# EAGLE board 6502-shield (EAGLE 9.6.0)
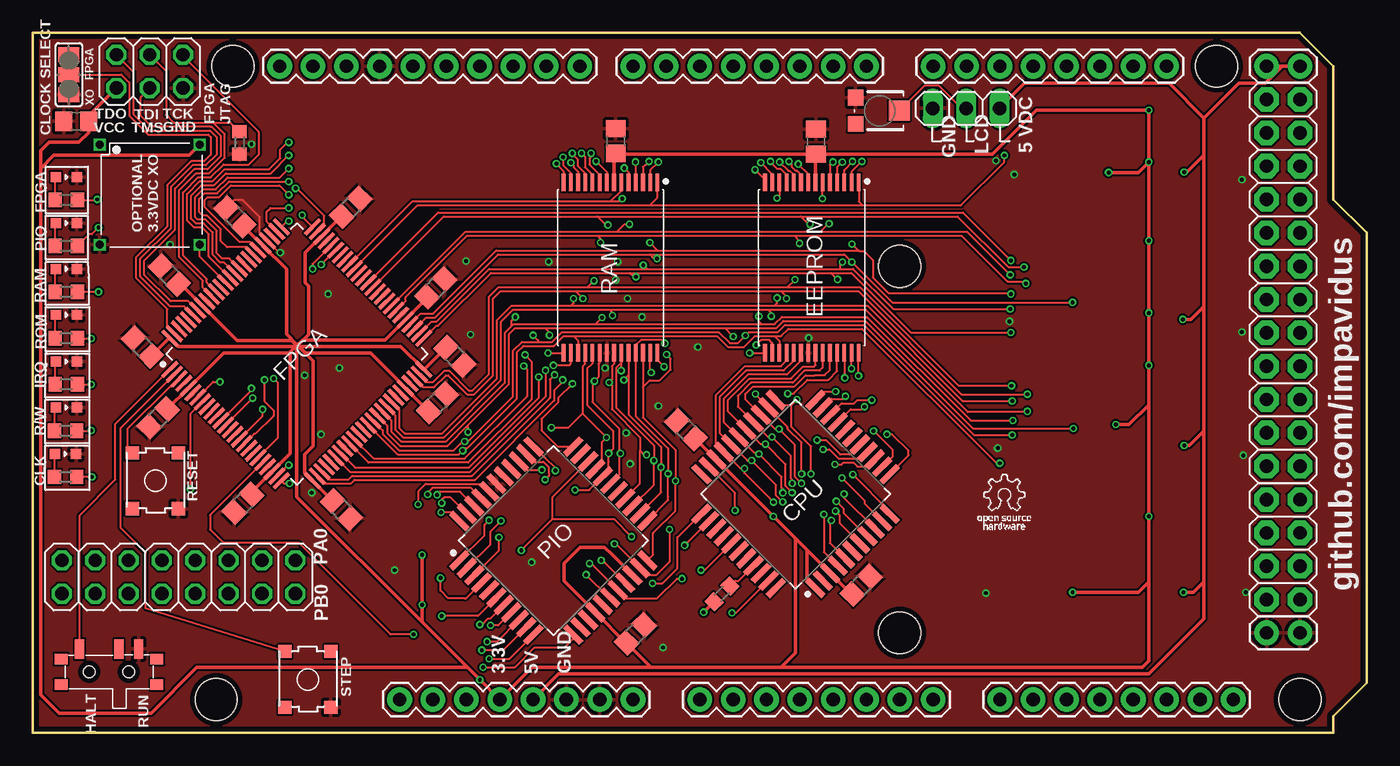
[diagram p3: board, top side]
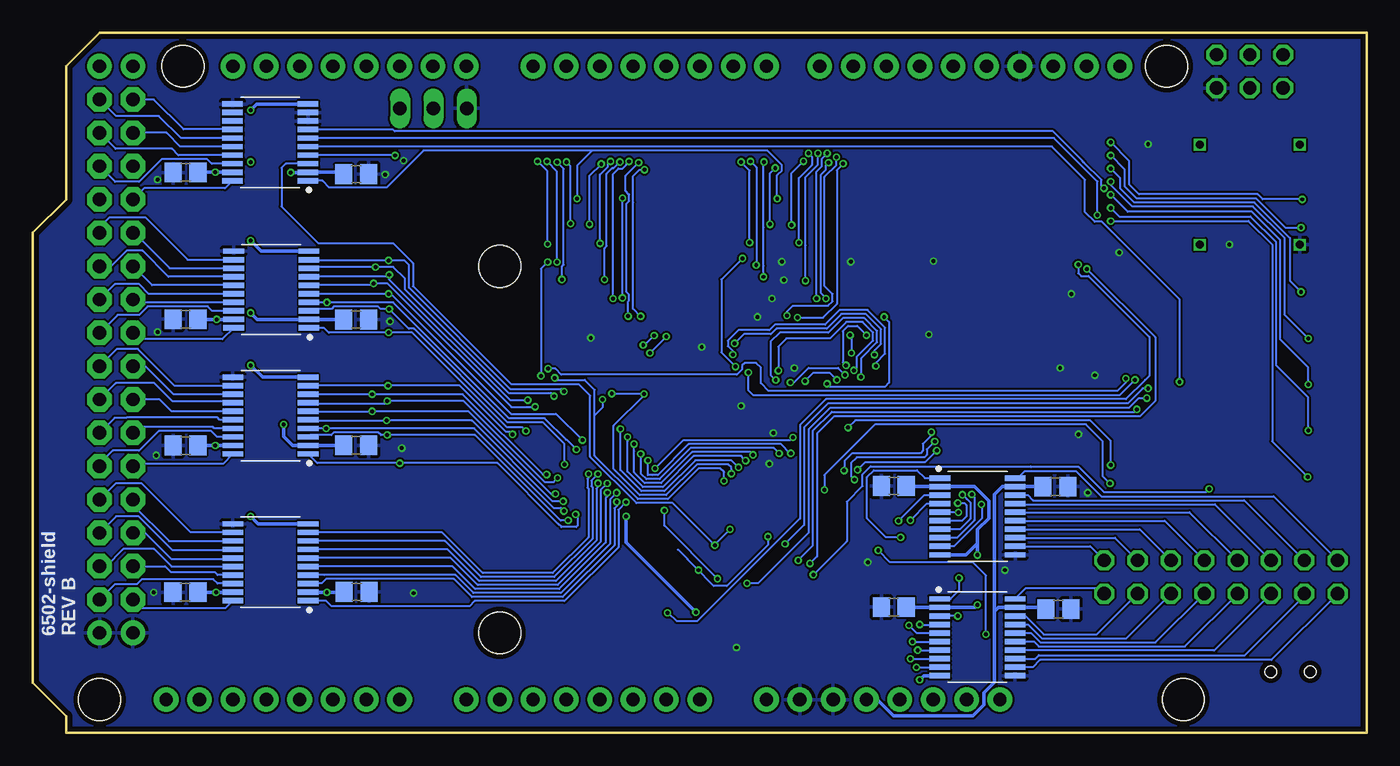
[diagram p4: board, bottom side, seen from below]

Size 101.6 x 53.34 mm. Coordinates in mm from the lower left corner, seen from the top.
Copper layers (1*16): Top 0.035559375mm / dielectric 1.6mm / Bottom 0.035559375mm
Design rules "oshpark-2layer": minimum track width 6mil, minimum drill 10mil, track to track 6mil, track to pad 6mil, pad to pad 6mil, via to via 6mil, smd to smd 6mil, copper to edge 15mil, drill to drill 6mil, minimum pad ring 5mil, minimum via ring 5mil, stop-mask expansion 2.5mil, vias tented up to drill 0mil, thermal gap 10mil
Net classes: 1 power: width 0.254 mm

## Footprints (pad centres in the part's own frame; a part is rotated, then mirrored left to right if it is on the bottom)
C0805 = smd 1.3 x 1.5: 1 -0.95,0; 2 0.95,0
QFP80P1320X1320X270-44N = smd 1.768 x 0.459: 1 -6.13,4; 2 -6.13,3.2; 3 -6.13,2.4; 4 -6.13,1.6; 5 -6.13,0.8; 6 -6.13,0; 7 -6.13,-0.8; 8 -6.13,-1.6; 9 -6.13,-2.4; 10 -6.13,-3.2; 11 -6.13,-4; 23 6.13,-4; 24 6.13,-3.2; 25 6.13,-2.4; 26 6.13,-1.6; 27 6.13,-0.8; 28 6.13,0; 29 6.13,0.8; 30 6.13,1.6; 31 6.13,2.4; 32 6.13,3.2; 33 6.13,4 | smd 0.459 x 1.768: 12 -4,-6.13; 13 -3.2,-6.13; 14 -2.4,-6.13; 15 -1.6,-6.13; 16 -0.8,-6.13; 17 0,-6.13; 18 0.8,-6.13; 19 1.6,-6.13; 20 2.4,-6.13; 21 3.2,-6.13; 22 4,-6.13; 34 4,6.13; 35 3.2,6.13; 36 2.4,6.13; 37 1.6,6.13; 38 0.8,6.13; 39 0,6.13; 40 -0.8,6.13; 41 -1.6,6.13; 42 -2.4,6.13; 43 -3.2,6.13; 44 -4,6.13
WL-SMCD_0603 = smd 0.8 x 0.75: 1 -0.8,0; 2 0.8,0
SOP55P1340X120-28N = smd 1.336 x 0.28: 1 -6.489,3.575; 2 -6.489,3.025; 3 -6.489,2.475; 4 -6.489,1.925; 5 -6.489,1.375; 6 -6.489,0.825; 7 -6.489,0.275; 8 -6.489,-0.275; 9 -6.489,-0.825; 10 -6.489,-1.375; 11 -6.489,-1.925; 12 -6.489,-2.475; 13 -6.489,-3.025; 14 -6.489,-3.575; 15 6.489,-3.575; 16 6.489,-3.025; 17 6.489,-2.475; 18 6.489,-1.925; 19 6.489,-1.375; 20 6.489,-0.825; 21 6.489,-0.275; 22 6.489,0.275; 23 6.489,0.825; 24 6.489,1.375; 25 6.489,1.925; 26 6.489,2.475; 27 6.489,3.025; 28 6.489,3.575
DIP8/4 = drill 0.6 square: 1 -3.81,-3.81; 4 3.81,-3.81; 5 3.81,3.81; 8 -3.81,3.81
QFP50P1600X1600X160-100N = smd 1.6 x 0.28: 1 -7.681,6; 2 -7.681,5.5; 3 -7.681,5; 4 -7.681,4.5; 5 -7.681,4; 6 -7.681,3.5; 7 -7.681,3; 8 -7.681,2.5; 9 -7.681,2; 10 -7.681,1.5; 11 -7.681,1; 12 -7.681,0.5; 13 -7.681,0; 14 -7.681,-0.5; 15 -7.681,-1; 16 -7.681,-1.5; 17 -7.681,-2; 18 -7.681,-2.5; 19 -7.681,-3; 20 -7.681,-3.5; 21 -7.681,-4; 22 -7.681,-4.5; 23 -7.681,-5; 24 -7.681,-5.5; 25 -7.681,-6; 51 7.681,-6; 52 7.681,-5.5; 53 7.681,-5; 54 7.681,-4.5; 55 7.681,-4; 56 7.681,-3.5; 57 7.681,-3; 58 7.681,-2.5; 59 7.681,-2; 60 7.681,-1.5; 61 7.681,-1; 62 7.681,-0.5; 63 7.681,0; 64 7.681,0.5; 65 7.681,1; 66 7.681,1.5; 67 7.681,2; 68 7.681,2.5; 69 7.681,3; 70 7.681,3.5; 71 7.681,4; 72 7.681,4.5; 73 7.681,5; 74 7.681,5.5; 75 7.681,6 | smd 0.28 x 1.6: 26 -6,-7.681; 27 -5.5,-7.681; 28 -5,-7.681; 29 -4.5,-7.681; 30 -4,-7.681; 31 -3.5,-7.681; 32 -3,-7.681; 33 -2.5,-7.681; 34 -2,-7.681; 35 -1.5,-7.681; 36 -1,-7.681; 37 -0.5,-7.681; 38 0,-7.681; 39 0.5,-7.681; 40 1,-7.681; 41 1.5,-7.681; 42 2,-7.681; 43 2.5,-7.681; 44 3,-7.681; 45 3.5,-7.681; 46 4,-7.681; 47 4.5,-7.681; 48 5,-7.681; 49 5.5,-7.681; 50 6,-7.681; 76 6,7.681; 77 5.5,7.681; 78 5,7.681; 79 4.5,7.681; 80 4,7.681; 81 3.5,7.681; 82 3,7.681; 83 2.5,7.681; 84 2,7.681; 85 1.5,7.681; 86 1,7.681; 87 0.5,7.681; 88 0,7.681; 89 -0.5,7.681; 90 -1,7.681; 91 -1.5,7.681; 92 -2,7.681; 93 -2.5,7.681; 94 -3,7.681; 95 -3.5,7.681; 96 -4,7.681; 97 -4.5,7.681; 98 -5,7.681; 99 -5.5,7.681; 100 -6,7.681
SJ_2 = smd 1.168 x 1.6: 1 -1.524,0; 2 0,0; 3 1.524,0
2X03 = drill 1.016 octagon: 1 -2.54,-1.27; 2 -2.54,1.27; 3 0,-1.27; 4 0,1.27; 5 2.54,-1.27; 6 2.54,1.27
2X08 = drill 1.016 octagon: 1 -8.89,-1.27; 2 -8.89,1.27; 3 -6.35,-1.27; 4 -6.35,1.27; 5 -3.81,-1.27; 6 -3.81,1.27; 7 -1.27,-1.27; 8 -1.27,1.27; 9 1.27,-1.27; 10 1.27,1.27; 11 3.81,-1.27; 12 3.81,1.27; 13 6.35,-1.27; 14 6.35,1.27; 15 8.89,-1.27; 16 8.89,1.27
1X03 = drill 1.016 long: 1 -2.54,0; 2 0,0; 3 2.54,0
MCSLPT4644B1TR-TACT-SW-NEW = smd 1 x 1: T1 0,0; T2 4.25,0; T3 0,-3.5; T4 4.25,-3.5
ARDUINO_MEGA2560 = drill 1.016 pad 1.88: 0 63.5,50.8; 1 60.96,50.8; 2 58.42,50.8; 3 55.88,50.8; 3.3V 35.56,2.54; 4 53.34,50.8; 5 50.8,50.8; 5V 38.1,2.54; 5V. 93.98,50.8; 5V.. 96.52,50.8; 6 48.26,50.8; 7 45.72,50.8; 8 41.656,50.8; 9 39.116,50.8; 10 36.576,50.8; 11 34.036,50.8; 12 31.496,50.8; 13 28.956,50.8; 14 68.58,50.8; 15 71.12,50.8; 16 73.66,50.8; 17 76.2,50.8; 18 78.74,50.8; 19 81.28,50.8; 20 83.82,50.8; 21 86.36,50.8; A0 50.8,2.54; A1 53.34,2.54; A2 55.88,2.54; A3 58.42,2.54; A4 60.96,2.54; A5 63.5,2.54; A6 66.04,2.54; A7 68.58,2.54; A8 73.66,2.54; A9 76.2,2.54; A10 78.74,2.54; A11 81.28,2.54; A12 83.82,2.54; A13 86.36,2.54; A14 88.9,2.54; A15 91.44,2.54; AREF 23.876,50.8; GND 26.416,50.8; GND. 43.18,2.54; GND.. 40.64,2.54; GND... 93.98,7.62; GND.... 96.52,7.62; I/OREF 30.48,2.54; N/C 27.94,2.54; RESET 33.02,2.54; SCL1 18.796,50.8; SDA1 21.336,50.8; VIN 45.72,2.54 | drill 1.016 pad 1.88 octagon: 22 93.98,48.26; 23 96.52,48.26; 24 93.98,45.72; 25 96.52,45.72; 26 93.98,43.18; 27 96.52,43.18; 28 93.98,40.64; 29 96.52,40.64; 30 93.98,38.1; 31 96.52,38.1; 32 93.98,35.56; 33 96.52,35.56; 34 93.98,33.02; 35 96.52,33.02; 36 93.98,30.48; 37 96.52,30.48; 38 93.98,27.94; 39 96.52,27.94; 40 93.98,25.4; 41 96.52,25.4; 42 93.98,22.86; 43 96.52,22.86; 44 93.98,20.32; 45 96.52,20.32; 46 93.98,17.78; 47 96.52,17.78; 48 93.98,15.24; 49 96.52,15.24; 50 93.98,12.7; 51 96.52,12.7; 52 93.98,10.16; 53 96.52,10.16 | hole 3.2: 15.24,50.8; 13.97,2.54; 66.04,35.56; 66.04,7.62; 90.17,50.8; 96.52,2.54
R0603 = smd 1 x 1.1: 1 -0.85,0; 2 0.85,0
TC33X = smd 1.2 x 1.2: 1 -1,-1.825; 3 1,-1.825 | smd 1.5 x 1.6: 2 0,1.5
PCM12SMTR = smd 0.711 x 1.499: 1 -2.235,1.74; 2 0.762,1.74; 3 2.261,1.74 | smd 0.991 x 0.813: P$1 3.645,-0.978; P$2 3.645,0.978; P$6 -3.645,0.978; P$7 -3.645,-0.978 | hole 0.889: 1.499,0; -1.499,0
SOP65P640X120-20N = smd 1.572 x 0.407: 1 -2.872,2.925; 2 -2.872,2.275; 3 -2.872,1.625; 4 -2.872,0.975; 5 -2.872,0.325; 6 -2.872,-0.325; 7 -2.872,-0.975; 8 -2.872,-1.625; 9 -2.872,-2.275; 10 -2.872,-2.925; 11 2.872,-2.925; 12 2.872,-2.275; 13 2.872,-1.625; 14 2.872,-0.975; 15 2.872,-0.325; 16 2.872,0.325; 17 2.872,0.975; 18 2.872,1.625; 19 2.872,2.275; 20 2.872,2.925

## Placement (x,y rotation side)
C1  0.1uF  [C0805]  24.21,40.05 45 top
C2  0.1uF  [C0805]  30.7,33.9 45 top
C3  0.1uF  [C0805]  10.4,34.88 135 top
C4  0.1uF  [C0805]  15.4,39.33 135 top
C5  0.1uF  [C0805]  9.55,24 225 top
C6  0.1uF  [C0805]  16,17.5 225 top
C7  0.1uF  [C0805]  3.3,46.6 180 top
C8  0.1uF  [C0805]  76.93,10.75 0 bottom
C9  0.1uF  [C0805]  76.98,21.91 0 bottom
C10  0.1uF  [C0805]  76.98,42.57 0 bottom
C11  0.1uF  [C0805]  36.02,18.81 180 bottom
C12  0.1uF  [C0805]  76.98,31.5 0 bottom
C13  0.1uF  [C0805]  36.02,9.59 180 bottom
C14  0.1uF  [C0805]  89.98,10.72 180 bottom
C15  0.1uF  [C0805]  89.97,31.52 180 bottom
C16  0.1uF  [C0805]  89.97,42.7 180 bottom
C17  0.1uF  [C0805]  89.97,21.89 180 bottom
C18  0.1uF  [C0805]  23.73,18.77 0 bottom
C19  0.1uF  [C0805]  23.48,9.43 0 bottom
C20  0.1uF  [C0805]  23.5,17 315 top
C21  0.1uF  [C0805]  30.8,25.15 45 top
C22  0.1uF  [C0805]  32.15,28.7 315 top
C23  0.1uF  [C0805]  8.35,29.4 135 top
C24  0.1uF  [C0805]  45.9,7.55 45 top
C25  0.1uF  [C0805]  49.75,23.1 135 top
C26  0.1uF  [C0805]  63.1,11.25 45 top
C27  0.1uF  [C0805]  59.65,45.05 90 top
C28  0.1uF  [C0805]  44.4,45.1 90 top
CPU  W65C02S  [QFP80P1320X1320X270-44N]  58.1,18.2 135 top
D1  RED  [WL-SMCD_0603]  2.5,21.25 180 top
D2  RED  [WL-SMCD_0603]  2.55,24.8 180 top
D3  RED  [WL-SMCD_0603]  2.55,35.35 180 top
D4  RED  [WL-SMCD_0603]  2.55,31.85 180 top
D5  RED  [WL-SMCD_0603]  2.55,28.3 180 top
D6  RED  [WL-SMCD_0603]  2.55,38.85 180 top
D7  RED  [WL-SMCD_0603]  2.55,42.35 180 top
EEPROM  AT28BV256TSOP-28  [SOP55P1340X120-28N]  59.34,35.45 270 top
EXT_XO  CRYSTAL-OSC-DIP8/4  [DIP8/4]  8.9,41 270 top
FPGA  MACHXO2-FPGA100TQFP  [QFP50P1600X1600X160-100N]  20.12,28.88 45 top
J1  [SJ_2]  2.75,50.15 270 top
JP1  [2X03]  8.9,50.4 0 top
JP2  [2X08]  11.1,11.87 180 top
JP3  [1X03]  71.09,47.59 180 top
PB_RESET  MCSLPT4644B1TR-TACT-SW  [MCSLPT4644B1TR-TACT-SW-NEW]  11.09,21.33 270 top
PB_STEP  MCSLPT4644B1TR-TACT-SW  [MCSLPT4644B1TR-TACT-SW-NEW]  22.7,6.2 270 top
PCB1  ARDUINO_MEGA2560  [ARDUINO_MEGA2560]  0,0 0 top
PIO  W65C22  [QFP80P1320X1320X270-44N]  39.65,14.65 45 top
R2  390  [R0603]  2.55,40.6 0 top
R3  4.7K  [R0603]  15.75,44.95 90 top
R4  390  [R0603]  2.55,37.1 0 top
R5  390  [R0603]  2.5,19.5 0 top
R6  390  [R0603]  2.5,23.02 0 top
R7  390  [R0603]  2.55,26.55 0 top
R8  390  [R0603]  2.55,30.06 0 top
R9  390  [R0603]  2.55,33.61 0 top
R18  10K  [R0603]  52.5,10.6 225 top
R19  10K  [TC33X]  64.5,47.4 270 top
RAM  AS6C62256  [SOP55P1340X120-28N]  44,35.45 270 top
SW_RUNHALT  PCM12SMTR-SPDT-RIGHT-ANG  [PCM12SMTR]  5.8,4.65 0 top
U1  TCB0108-LVL-XLTRTSSOP20  [SOP65P640X120-20N]  83.43,33.78 180 bottom
U2  TCB0108-LVL-XLTRTSSOP20  [SOP65P640X120-20N]  83.5,24.17 180 bottom
U3  TCB0108-LVL-XLTRTSSOP20  [SOP65P640X120-20N]  83.5,13 180 bottom
U4  TCB0108-LVL-XLTRTSSOP20  [SOP65P640X120-20N]  29.64,16.49 0 bottom
U5  TCB0108-LVL-XLTRTSSOP20  [SOP65P640X120-20N]  29.66,7.28 0 bottom
U6  TCB0108-LVL-XLTRTSSOP20  [SOP65P640X120-20N]  83.51,44.99 180 bottom
U$1  OSHW_LOGO  [OSHW_LOGO@1]  72,15.5 0 top

## Tracks (layer width: path | path; a pad name or v marks a point on that pad's centre or on a via)
A0  (via drill 0.3)
  Top 0.152: FPGA.38 27.79,21.2 32.45,21.2 v32.75,21.5 32.95,21.7 33.11,21.7 36.88,25.48 36.88,29 37.37,29.49 39.69,29.49 40.43,30.24 41.2,30.24 | 41.2,30.24 52.12,30.24 52.96,29.39 54.15,29.39 55,30.24 56.5,30.24 | 56.5,30.24 56.86,29.87 EEPROM.17 | 41.2,30.24 41.52,29.91 RAM.17 | 56.5,30.24 57,30.24 57.55,30.79 63.16,30.79 73.4,20.55 v73.65,20.55 | PIO.36 37.65,20.04 v38.77,20.04 | v60.25,16.65 60.25,13.79 CPU.4
  Bottom 0.152: U2.1 79.92,20.55 v73.65,20.55 66.2,20.55 61.58,15.93 | v32.75,21.5 33.65,20.61 38.2,20.61 v38.77,20.04 | v60.25,16.65 60.1,16.5 60.1,15.79 60.21,15.68 61.33,15.68 61.58,15.93 | 61.58,15.93
A0_IO
  Bottom 0.152: U2.20 87.12,20.5 93.8,20.5 PCB1.44
A1  (via drill 0.3)
  Top 0.152: FPGA.39 26.65,23.05 26.65,22.78 27.92,21.51 32.04,21.51 32.54,22.01 32.55,22.01 32.75,22.21 v32.9,22.21 33.16,22.21 36.58,25.63 36.58,29.13 37.25,29.79 38.5,29.79 | 38.5,29.79 39.56,29.79 40.3,30.54 52.24,30.54 53.09,29.69 53.7,29.69 54.27,30.27 v54.27,30.27 54.54,30.54 56.75,30.54 57.3,31.09 63.29,31.09 71.69,22.69 v74.6,22.69 | v39.65,28 40.85,28 40.98,28.12 RAM.16 | v38.1,30.3 38.5,29.89 38.5,29.79 | EEPROM.16 56.31,29.72 56.1,29.93 55.48,29.93 v55.1,29.55 | PIO.35 38.17,20.65 38.9,20.65 39.3,20.25 39.3,19.78 39.3,19.77 39.3,19.57 v39.02,19.29 | v60.82,16.18 60.7,16.07 60.7,14.47 CPU.5
  Bottom 0.152: U2.3 80.48,22.69 78.87,22.69 78.67,22.89 75.28,22.89 75.08,22.69 v74.6,22.69 67.91,22.69 61.4,16.18 v60.82,16.18 | v32.9,22.21 33.5,21.61 33.5,21.19 33.69,21 38.83,21 39.28,20.55 39.28,19.55 v39.02,19.29 | v39.65,28 39.9,28.25 39.9,30.6 39.5,31 38.8,31 v38.1,30.3 | v54.27,30.27 55,29.55 v55.1,29.55
A1_IO
  Bottom 0.152: U2.18 87.55,22.55 88,23 92,23 93.5,21.5 95.5,21.5 96.52,20.48 PCB1.45
A2  (via drill 0.3)
  Top 0.152: FPGA.40 27,23.41 27,22.86 27.98,21.87 31.58,21.87 33.15,23.45 | 33.15,23.45 36.27,26.57 36.27,30.37 36.74,30.84 39,30.84 | v79.25,23.2 71.61,23.2 63.42,31.39 57.18,31.39 56.63,30.84 52.7,30.84 | 39,30.84 52.7,30.84 | 39,30.84 39.35,30.5 v39.35,30.3 | RAM.15 40.36,28.9 39.3,28.9 v39.25,28.95 | v53.35,30.2 52.7,30.84 | v33.15,22.91 33.15,23.45 | v54.6,28.95 v54.61,28.96 EEPROM.15 | PIO.34 39,20.95 39.03,20.95 39.81,20.18 v39.81,19.99 | v61.15,16.9 61.45,16.6 61.45,15.98 CPU.7
  Bottom 0.152: U2.4 v79.25,23.2 67.99,23.2 61.94,17.15 61.4,17.15 v61.15,16.9 | v39.35,30.3 39.25,30.2 v39.25,28.95 | v54.6,28.95 v53.35,30.2 | v33.15,22.91 33.15,22.68 33.8,22.02 33.8,21.5 34,21.3 39.21,21.3 39.78,20.73 39.78,20.02 v39.81,19.99
A2_IO
  Bottom 0.152: U2.17 87.77,23.2 87.87,23.3 93.53,23.3 PCB1.42
A3  (via drill 0.3)
  Top 0.152: FPGA.41 27.3,23.81 27.3,22.98 28.07,22.22 31.49,22.22 35.97,26.7 35.97,30.5 36.48,31.02 | 36.48,31.02 36.62,31.15 42.86,31.15 | v74.65,23.79 71.45,23.79 63.54,31.7 57.05,31.7 56.5,31.15 55.5,31.15 | 42.86,31.15 55.5,31.15 | 42.86,31.15 v43.35,31.64 | v39.88,43.38 40.09,43.17 40.09,43.13 40.42,42.79 RAM.14 | 55.5,31.15 55.3,31.35 v55.3,31.74 | v55,42.9 55.76,42.14 EEPROM.14 | 36.48,31.02 36.48,31.43 v36.75,31.7 | v41.1,26.6 40.02,25.52 40.02,25.18 38.75,23.92 38.75,23.05 39.99,21.81 PIO.33 | v61.2,17.65 61.75,17.1 61.75,16.75 63.5,15 CPU.8
  Bottom 0.152: U2.5 80.57,23.79 v74.65,23.79 68.15,23.79 62.01,17.65 v61.2,17.65 | v43.35,31.64 41.4,31.64 40.36,32.68 40.36,42.87 39.88,43.35 v39.88,43.38 | v55.3,31.74 55.88,32.32 55.88,40.39 55.86,40.41 55.86,42.44 55.4,42.9 v55,42.9 | v36.75,31.7 36.38,31.32 36.38,26.69 36.7,26.36 40.87,26.36 v41.1,26.6
A3_IO
  Bottom 0.152: U2.16 87.35,23.85 87.53,24.03 94.46,24.03 94.49,24 95.38,24 PCB1.43
A4  (via drill 0.3)
  Top 0.152: FPGA.42 27.61,24.21 27.61,23.11 28.2,22.52 31.31,22.52 35.66,26.88 35.66,31.32 36.59,32.24 43.95,32.24 | v75.75,24.5 75.7,24.45 71.22,24.45 63.43,32.24 56,32.24 | 43.95,32.24 56,32.24 | v44.15,31.8 44.15,32.05 43.95,32.24 | RAM.13 40.99,41.96 40.99,42.65 40.39,43.25 v40.39,43.86 | 56,32.24 56.25,32 v56.25,31.75 | v55.45,43.45 56.31,42.59 EEPROM.13 | v61.8,18.2 61.8,17.89 CPU.9
  Bottom 0.152: U2.6 v75.75,24.5 68.43,24.5 62.13,18.2 v61.8,18.2 | v44.15,31.8 44.15,32.1 43.7,32.55 41.02,32.55 40.69,32.88 40.69,33.44 41.29,34.04 41.29,42.37 40.39,43.27 v40.39,43.86 | v56.25,31.75 56.25,32.87 56.19,32.93 56.19,33.39 56.39,33.59 56.39,40.31 56.17,40.53 56.17,41.02 56.45,41.3 56.45,42.45 v55.45,43.45
A4_IO
  Bottom 0.152: U2.15 91.03,24.5 91.93,25.4 PCB1.40
A5  (via drill 0.3)
  Top 0.152: FPGA.43 27.91,24.62 27.91,23.24 28.32,22.83 31.18,22.83 35.36,27.01 35.36,31.45 36.46,32.55 41,32.55 | v74.6,25.29 70.81,25.29 63.55,32.55 56.5,32.55 | 41,32.55 56.5,32.55 | 41,32.55 41.19,32.74 v41.19,33.09 | v40.99,43.46 41.19,43.26 41.19,43.1 41.52,42.76 RAM.12 | 56.5,32.55 56.69,32.74 v56.69,33.14 | EEPROM.12 56.88,41.92 56.88,40.95 v56.67,40.74 | v61.63,19.42 63.35,17.7 63.35,17.48 CPU.10
  Bottom 0.152: U2.7 80.58,25.15 80.53,25.09 74.8,25.09 v74.6,25.29 68.79,25.29 62.61,19.12 61.93,19.12 v61.63,19.42 | v41.19,33.09 41.19,33.14 41.59,33.54 41.59,42.5 41.19,42.9 41.19,43.25 v40.99,43.46 | v56.67,40.74 56.69,40.76 v56.69,33.14
A5_IO
  Bottom 0.152: U2.14 86.52,25.3 91,25.3 92.35,26.65 95.27,26.65 PCB1.41
A6  (via drill 0.3)
  Top 0.152: FPGA.48 29.72,26.35 30.58,26.35 31.47,27.23 31.63,27.23 33.07,25.8 33.63,25.8 35.05,27.22 35.05,33.08 35.62,33.65 41.35,33.65 | v75.75,25.8 70.73,25.8 62.89,33.65 57,33.65 | 41.35,33.65 57,33.65 | 41.35,33.65 v41.9,33.1 | v41.09,44.16 41.09,44.11 41.49,43.71 41.49,43.22 42.08,42.64 RAM.11 | 57,33.65 57.4,33.24 v57.4,33.1 | v56.18,43.54 56.16,43.52 56.69,42.99 56.95,42.99 57.41,42.52 EEPROM.11 | v62.46,19.68 65.26,16.87 CPU.11
  Bottom 0.152: U2.8 v75.75,25.8 68.86,25.8 62.74,19.68 v62.46,19.68 | v41.9,33.1 41.9,42.77 41.49,43.18 41.49,43.75 41.29,43.95 41.29,43.96 v41.09,44.16 | v57.4,33.1 57.4,42.59 57,42.99 56.68,42.99 56.38,43.29 56.38,43.34 v56.18,43.54
A6_IO
  Bottom 0.152: U2.13 90.89,25.8 93.03,27.94 PCB1.38
A7  (via drill 0.3)
  Top 0.152: FPGA.49 30.07,26.7 30.45,26.7 31.35,27.6 31.7,27.6 33.2,26.1 33.5,26.1 34.75,27.35 34.75,33.23 35.47,33.95 42.25,33.95 | v74.55,26.45 70.52,26.45 63.02,33.95 57.5,33.95 | 42.25,33.95 57.5,33.95 | 42.25,33.95 v42.75,34.45 | RAM.10 42.62,42.52 42.05,43.1 42.05,43.91 v41.8,44.16 | 57.5,33.95 58.05,34.5 v58.05,34.54 | v56.89,43.5 57.55,42.84 57.65,42.84 57.96,42.52 EEPROM.10 | CPU.12 66.7,21.14 66.7,21.5 65.45,22.75 v65.05,22.75
  Bottom 0.152: U2.9 v74.55,26.45 69.08,26.45 65.58,22.95 65.25,22.95 v65.05,22.75 | v42.75,34.45 42.75,37.13 42.74,37.14 42.74,42.36 41.8,43.31 v41.8,44.16 | v58.05,34.54 58.05,36.94 57.89,37.09 57.89,42.61 57.47,43.04 57.38,43.04 56.92,43.5 v56.89,43.5
A7_IO
  Bottom 0.152: U2.12 90.8,26.45 93.6,29.25 95.2,29.25 PCB1.39
A8  (via drill 0.3)
  Top 0.152: FPGA.51 30.76,31.04 30.88,31.04 34.89,35.05 45.45,35.05 | 60.8,35.05 62.35,35.05 66.9,30.5 v74.5,30.5 | 45.45,35.05 60.8,35.05 | 60.8,35.05 v61.3,34.55 | v61.66,43.48 61.26,43.09 EEPROM.4 | v45.95,34.75 45.75,34.75 45.45,35.05 | v45.9,43.5 45.92,43.48 RAM.4 | CPU.13 65.5,21.07 65.5,21.55 v64.05,23 v64.04,23
  Bottom 0.152: U1.1 79.41,30.85 79.06,30.5 v74.5,30.5 72.7,30.5 65.51,23.31 64.35,23.31 v64.04,23 | v61.3,34.55 61.3,35.53 61.17,35.66 61.17,42.99 v61.66,43.48 | v45.95,34.75 45.95,35.59 45.94,35.59 45.94,38.53 45.96,38.54 45.96,43.44 v45.9,43.5
A8_IO
  Bottom 0.152: U1.20 87.16,30 93.5,30 PCB1.36
A9  (via drill 0.3)
  Top 0.152: FPGA.52 30.36,31.34 30.75,31.34 34.76,35.35 46.8,35.35 | v74.45,32.29 65.53,32.29 62.48,35.35 61.5,35.35 | 46.8,35.35 61.5,35.35 | 46.8,35.35 v46.5,35.65 | v46.94,43.54 46.67,43.27 46.64,43.27 46.48,43.11 RAM.3 | 61.5,35.35 61.5,35.7 v61.67,35.87 | v62.44,43.54 62.44,43.51 61.81,42.89 EEPROM.3 | v61.1,20.45 61.6,20.45 61.74,20.59 62.51,20.59 62.8,20.3 63.59,20.3 CPU.14
  Bottom 0.152: U1.3 80.42,32.29 78.85,32.29 78.67,32.48 75.28,32.48 75.1,32.29 v74.45,32.29 72.96,30.8 72.58,30.8 65.43,23.66 62.74,23.66 61.1,22.02 v61.1,20.45 | v46.5,35.65 v46.49,35.65 46.49,43.09 v46.94,43.54 | v61.67,35.87 61.67,42.78 v62.44,43.54
A9_IO
  Bottom 0.152: U1.18 87.94,32.15 88.28,32.49 92.85,32.49 93.5,31.85 95.15,31.85 PCB1.37
A10  (via drill 0.3)
  Top 0.152: FPGA.53 29.95,31.64 30.63,31.64 35.43,36.45 47,36.45 | v79.2,32.8 65.46,32.8 v62.38,35.88 61.81,36.45 47,36.45 | v62.9,27.2 62.9,28.95 EEPROM.28 | 47,36.45 47.3,36.15 v47.55,36.15 | v48.07,27.91 47.58,28.41 RAM.28 | v60.2,21.6 60.67,21.6 61.37,20.89 63.06,20.89 CPU.15
  Bottom 0.152: U1.4 v79.2,32.8 74.14,32.8 65.31,23.97 62.61,23.97 61,22.35 60.95,22.35 v60.2,21.6 | v62.38,35.88 62.9,35.36 v62.9,27.2 | v47.55,36.15 49.15,34.55 49.15,28.98 v48.07,27.91
A10_IO
  Bottom 0.152: U1.17 93.76,32.8 PCB1.34
A11  (via drill 0.3)
  Top 0.152: FPGA.54 29.55,31.95 30.5,31.95 35.3,36.75 47.6,36.75 | 47.6,36.75 62.9,36.75 | v74.5,33.45 74.45,33.5 65.19,33.5 63.98,34.71 63.98,36.02 63.3,36.7 62.95,36.7 62.9,36.75 | 62.9,36.75 v62.4,37.25 | v63.15,43.54 62.36,42.76 EEPROM.2 | 47.6,36.75 v47,37.35 | v47.65,43.5 47.02,42.88 RAM.2 | v59.74,22.31 60.39,22.31 61.5,21.2 62.23,21.2 CPU.16
  Bottom 0.152: U1.5 v74.5,33.45 74.31,33.45 65.17,24.31 61.75,24.31 v59.74,22.31 | v62.4,37.25 62.4,42.79 v63.15,43.54 | v47,37.35 47,42.85 v47.65,43.5
A11_IO
  Bottom 0.152: U1.16 92.76,33.45 93.5,34.19 95.35,34.19 PCB1.35
A12  (via drill 0.3)
  Top 0.152: FPGA.57 28.4,32.92 28.4,33.2 33.09,37.89 43,37.89 | v75.65,34.25 75.5,34.39 74.24,34.39 70.75,37.89 58,37.89 | 43,37.89 58,37.89 | 58,37.89 58.4,37.49 v58.4,37.3 | v57.59,43.54 57.79,43.34 57.79,43.14 58.09,42.84 58.19,42.84 58.51,42.52 EEPROM.9 | 43,37.89 43.25,37.64 v43.25,37.35 | v42.51,44.16 42.51,43.88 42.39,43.76 42.39,43.3 43.17,42.52 RAM.9 | CPU.19 62.29,24.65 63.15,24.65 v63.35,24.85
  Bottom 0.152: U1.6 75.81,34.1 75.67,34.25 v75.65,34.25 74.58,34.25 73.89,33.56 73.89,33.57 65.15,24.82 63.38,24.82 v63.35,24.85 | v57.59,43.54 57.79,43.34 57.79,43.14 58.4,42.53 v58.4,37.3 | v43.25,37.35 43.25,42.28 42.26,43.27 42.26,43.91 v42.51,44.16
A12_IO
  Bottom 0.152: U1.15 92.52,34.1 PCB1.32
A13  (via drill 0.3)
  Top 0.152: FPGA.58 32.96,38.19 44.5,38.19 | v74.45,34.9 71.16,38.19 60,38.19 | 44.5,38.19 60,38.19 | 60,38.19 60.61,38.8 v60.65,38.8 | v60.95,43.5 60.71,43.26 EEPROM.5 | 44.5,38.19 45.06,38.75 v45.45,38.75 | v45.05,43.04 45.38,42.72 RAM.5 | CPU.20 61.61,25.1 62.55,25.1 62.8,25.36 63.56,25.36 63.56,25.35 v63.9,25.35
  Bottom 0.152: U1.7 74.56,34.75 74.47,34.85 74.47,34.88 v74.45,34.9 74.45,34.55 65.25,25.35 v63.9,25.35 | v60.65,38.8 60.65,43.2 v60.95,43.5 | v45.45,38.75 45.45,42.64 v45.05,43.04
A13_IO
  Bottom 0.152: U1.14 91.27,34.75 93.25,36.73 94.46,36.73 95.63,35.56 PCB1.33
A14  (via drill 0.3)
  Top 0.152: FPGA.62 31.29,39.34 43,39.34 | v75.5,35.49 74.29,35.49 70.44,39.34 58.5,39.34 | 43,39.34 58.5,39.34 | 43,39.34 43.65,38.7 v43.8,38.7 | v42.9,43.55 43.73,42.73 RAM.8 | 58.5,39.34 59.09,38.75 v59.2,38.75 | v58.3,43.35 59.06,42.59 EEPROM.8 | CPU.21 60.83,25.45 61.7,25.45 v61.9,25.65
  Bottom 0.152: U1.8 80.47,35.49 v75.5,35.49 74.29,35.49 74.28,35.5 74.15,35.5 73.25,34.6 73.25,33.78 65.36,25.9 62.15,25.9 v61.9,25.65 | v43.8,38.7 43.8,42.65 v42.9,43.55 | v59.2,38.75 59.2,42.45 v58.3,43.35
A14_IO
  Bottom 0.152: U1.13 91.18,35.4 93.88,38.1 PCB1.30
A15  (via drill 0.3)
  Top 0.152: FPGA.63 30.89,39.65 70.85,39.65 v74.5,36 | CPU.22 60.25,26.01 v61.15,26.01
  Bottom 0.152: U1.9 80.51,36 v74.5,36 73.3,36 72.94,35.65 72.94,33.91 65.24,26.2 61.35,26.2 v61.15,26.01
A15_IO
  Bottom 0.152: U1.12 89.81,36.05 93.02,39.27 95.76,39.27 96.52,38.51 PCB1.31
BE  (via drill 0.3)
  Top 0.152: v16.75,25.5 16.74,25.5 FPGA.13 | v47.2,11.4 47.95,11.4 49.1,12.55 49.1,14.9 50.89,16.69 CPU.34
  Bottom 0.152: v16.75,25.5 17.37,25.5 18.11,24.76 40.87,24.76 42.51,23.13 42.51,15.24 46.35,11.4 v47.2,11.4
CLK  (via drill 0.3)
  Top 0.152: FPGA.12 16.65,26.12 v16.65,26.25 | v48.5,15.5 v48.49,15.49 48.49,13.03 47.48,12.02 46.83,12.02 46.27,12.58 PIO.21 44.42,14.4 v44.3,14.4 | v49.65,14.3 51.48,16.13 CPU.35
  Bottom 0.152: v16.65,26.25 17.05,26.25 18.19,25.11 41.02,25.11 42.85,23.28 42.85,15.85 v44.3,14.4 | v48.5,15.5 49.65,14.35 v49.65,14.3 52.86,17.51 55.63,17.51 59.15,21.03 59.15,25.7 59.99,26.54 65.15,26.54 72.64,34.04 72.64,35.79 74.15,37.3 79.85,37.3 82.65,40.1 82.65,43.05 82.33,43.37 U6.3
CLK_IO
  Bottom 0.152: U6.18 87.96,43.37 88.31,43.71 91.79,43.71 93.5,42 95.34,42 PCB1.27
CLK_SEL
  Top 0.152: J1.2 6.74,50.15 7.35,49.54 7.35,48.72 7.35,47.02 8.79,45.59 13.36,45.59 13.55,45.4 13.55,44.05 13.05,43.55 12.05,43.55 10.23,41.73 10.23,38.59 7.89,36.25 7.89,34.65 10.25,32.29 10.25,30.97 FPGA.99
D0  (via drill 0.3)
  Top 0.152: FPGA.24 19.37,20.35 19.45,20.35 v19.5,20.4 | v39.5,23.25 40.8,23.25 41.88,24.32 | EEPROM.18 57.41,28.36 57,27.95 54.25,27.95 52,25.7 52,22.04 CPU.30 53.89,20.15 v54.2,20.15 54.2,19.79 v56.41,17.58 | 41.88,24.32 41.88,27.91 42.08,28.11 RAM.18 | 41.88,24.32 v43.7,22.5 43.35,22.15 43.35,20.61 PIO.30
  Bottom 0.152: v19.5,20.4 19.5,22.25 21.05,23.8 38.95,23.8 v39.5,23.25 | v43.7,22.5 43.9,22.3 52.05,22.3 v54.2,20.15 | v56.41,17.58 57,16.99 57,14.15 61.1,10.05 67.95,10.05 68.35,9.65 78.85,9.65 79.28,10.07 U3.1
D0_IO
  Bottom 0.152: U3.20 86.95,9.5 93.32,9.5 PCB1.52
D1  (via drill 0.3)
  Top 0.152: FPGA.25 19.13,19 v19.55,19 | RAM.19 42.62,28.16 42.23,27.76 42.23,24.99 44.21,23.01 44.21,21.64 v43.87,21.3 43.87,20.68 43.87,20.67 43.87,20 PIO.29 42.37,18.5 v41.3,18.5 | EEPROM.19 57.93,28.93 57.93,28.35 57.19,27.6 54.33,27.6 52.3,25.57 52.3,22.86 CPU.29 54.42,20.75 v54.75,20.75 56.62,18.88 56.62,18.09 v57.12,17.59 | v57.12,17.59
  Bottom 0.152: v19.55,19 20.1,19.55 20.1,22.22 21.38,23.5 37.45,23.5 41.3,19.65 v41.3,18.5 | v43.87,21.3 43.91,21.3 44.61,22 51.64,22 53.99,19.64 54.41,19.64 54.41,19.65 54.75,19.65 v54.75,20.75 | v57.12,17.59 57.12,17.3 57.3,17.12 57.3,14.3 61.25,10.36 68.16,10.36 69.53,11.73 79.26,11.73 79.6,11.39 80.61,11.39 U3.3
D1_IO
  Bottom 0.152: U3.18 87.53,11.38 87.85,11.7 93.3,11.7 93.67,11.33 95.35,11.33 PCB1.53
D2  (via drill 0.3)
  Top 0.152: FPGA.27 22.22,19 24.23,19 24.51,19.27 33.67,19.27 39.71,25.31 39.71,26.1 40.36,26.75 v40.36,26.9 | RAM.20 43.17,28.21 43.08,28.11 43.08,27.1 v42.77,26.8 42.62,26.65 42.62,25.23 44.65,23.2 44.65,21.39 44.7,21.34 | 44.7,21.34 v44.75,21.29 | EEPROM.20 58.53,28.94 58.53,28.4 57.43,27.3 54.46,27.3 52.61,25.45 52.61,23.69 CPU.28 55.05,21.25 v55.3,21.25 57.03,19.52 57.03,18.68 57.13,18.58 v57.13,18.3 | PIO.28 44.7,19.7 44.7,21.34
  Bottom 0.152: v40.36,26.9 40.91,27.45 42.12,27.45 v42.77,26.8 | v44.75,21.29 45.15,21.69 51.51,21.69 53.86,19.34 54.87,19.34 55.26,19.73 55.26,21.21 v55.3,21.25 | v57.13,18.3 57.62,17.8 57.62,14.41 61.38,10.66 68.03,10.66 69.4,12.03 79.39,12.03 79.4,12.03 U3.4
D2_IO
  Bottom 0.152: U3.17 87.53,12.03 87.75,12.25 91.08,12.25 91.53,12.7 PCB1.50
D3  (via drill 0.3)
  Top 0.152: FPGA.28 22.62,19.3 24.05,19.3 24.32,19.58 33.45,19.58 39.4,25.53 39.4,26.93 v39.74,27.28 | 46.25,21.5 46.25,22.52 44.11,24.66 44.11,26.5 v43.91,26.7 44.11,26.9 44.11,27.95 44.27,28.11 RAM.22 | 46.25,21.5 46.56,21.18 v46.75,21.18 | EEPROM.22 59.61,28.01 59.5,27.9 58.67,27.9 57.76,26.99 54.58,26.99 52.91,25.32 52.91,24.52 CPU.27 55.43,22 v55.8,22 57.34,20.46 57.34,18.8 v57.83,18.3 | PIO.26 46.25,18.99 46.25,21.5 | v57.83,18.3
  Bottom 0.152: v43.91,26.7 43.61,26.7 42.5,27.81 40.27,27.81 v39.74,27.28 | v46.75,21.18 46.95,21.39 51.39,21.39 53.74,19.04 55,19.04 55.81,19.84 55.81,21.46 55.8,21.46 v55.8,22 | v57.83,18.3 57.83,18.02 57.96,17.89 57.96,14.5 61.5,10.96 67.9,10.96 69.61,12.68 U3.5
D3_IO
  Bottom 0.152: U3.16 91.03,12.68 92.37,14.02 94.7,14.02 96.02,12.7 PCB1.51
D4  (via drill 0.3)
  Top 0.152: FPGA.31 24.16,19.89 33.32,19.89 39.05,25.61 v39.05,27.62 | v47.3,20.74 47.3,21.9 44.42,24.77 44.42,27.81 44.83,28.21 RAM.23 v44.83,27.61 v44.82,27.6 | v47.3,20.74 v47.31,20.74 | EEPROM.23 60.16,27.83 59.93,27.59 58.79,27.59 57.88,26.69 54.71,26.69 53.7,25.68 53.7,24.86 CPU.26 56.01,22.55 v56.3,22.55 57.75,21.1 57.75,19.39 57.84,19.29 v57.84,19.01 | PIO.25 47.3,18.91 v47.3,20.74
  Bottom 0.152: v39.05,27.62 38.85,27.82 38.85,28.64 37.59,29.89 37.59,30.5 38.4,31.3 39.63,31.3 40.88,30.05 44.2,30.05 44.82,29.43 v44.82,27.6 | v47.31,20.74 47.49,20.93 47.49,20.94 47.63,21.08 51.26,21.08 53.61,18.73 55.12,18.73 56.31,19.91 56.31,22.21 56.3,22.21 v56.3,22.55 | v57.84,19.01 58.34,18.51 58.34,14.56 61.63,11.27 67.72,11.27 69.78,13.32 U3.6
D4_IO
  Bottom 0.152: U3.15 86.42,13.28 91.08,13.28 93.05,15.25 93.44,15.25 93.45,15.24 PCB1.48
D5  (via drill 0.3)
  Top 0.152: FPGA.32 24.54,20.21 33.22,20.21 38.54,25.53 v38.54,27.11 | RAM.24 45.38,27.25 | 45.38,27.25 45.38,24.26 47.85,21.79 v47.85,20.24 47.85,18.32 PIO.24 | v45.01,26.89 45.38,27.25 | EEPROM.24 60.71,27.66 60.3,27.25 59.56,27.25 59.55,27.24 58.87,27.24 58.01,26.38 54.84,26.38 54.28,25.82 54.28,25.42 CPU.25 56.54,23.15 v56.85,23.15 58.05,21.95 58.05,19.52 v58.55,19.02 | v58.55,19.02
  Bottom 0.152: v38.54,27.11 38.5,27.15 38.5,28.55 37.29,29.76 37.29,30.63 38.27,31.61 39.89,31.61 41,30.5 44.7,30.5 45.4,29.8 45.4,27.28 v45.01,26.89 | v47.85,20.24 48.39,20.78 51.13,20.78 53.49,18.43 55.25,18.43 56.85,20.03 v56.85,23.15 | v58.55,19.02 58.55,18.73 58.67,18.61 58.67,14.65 61.76,11.57 67.59,11.57 69.99,13.97 U3.7
D5_IO
  Bottom 0.152: U3.14 86.42,13.93 90.97,13.93 93.55,16.5 95.26,16.5 PCB1.49
D6  (via drill 0.3)
  Top 0.152: FPGA.34 25.57,20.59 33.17,20.59 37.99,25.41 37.99,28.31 v37.49,28.81 | v48.14,29.68 47.89,29.93 46.31,29.93 45.92,29.54 RAM.25 45.92,24.14 48.4,21.67 v48.4,19.75 48.4,18 48.4,17.74 PIO.23 | EEPROM.25 61.26,27.56 60.6,26.9 59,26.9 57.95,25.85 v57.5,25.85 | v55.04,25.82 55.04,25.78 CPU.24 56.35,24.45 57.49,23.3 57.49,23.17 58.56,22.11 v58.56,19.73
  Bottom 0.152: v37.49,28.81 37.49,29.13 36.98,29.64 36.98,30.76 38.14,31.91 40.02,31.91 41.13,30.8 44.95,30.8 45.38,30.38 47.45,30.38 v48.14,29.68 | v48.4,19.75 48.4,20.22 48.65,20.47 51.01,20.47 53.36,18.12 55.38,18.12 57.36,20.1 57.36,23.4 55.04,25.72 v55.04,25.82 55.09,25.87 57.48,25.87 v57.5,25.85 | v58.56,19.73 59.05,19.23 59.05,18.81 58.98,18.73 58.98,14.78 61.88,11.88 67.47,11.88 70.21,14.62 U3.8
D6_IO
  Bottom 0.152: U3.13 91.22,14.62 93.98,17.38 PCB1.46
D7  (via drill 0.3)
  Top 0.152: FPGA.35 24.49,22.37 25.96,20.9 32.89,20.9 37.64,25.64 37.64,27.71 v37.39,27.96 | RAM.26 46.48,26.35 | 46.48,26.35 46.48,24.02 48.95,21.55 v48.95,19.2 48.95,16.92 47.25,15.22 47.25,13.58 PIO.22 | 46.48,26.35 46.98,26.85 47.75,26.85 48.58,27.68 48.58,28.52 v48.28,28.82 | EEPROM.26 61.81,27.09 v61.85,27.05 | CPU.23 56.96,25 57.8,25 | 57.8,25 v58.2,25.4 | v59.27,19.72 59.27,21.83 57.8,23.3 57.8,25
  Bottom 0.152: v37.39,27.96 37.39,28.2 36.68,28.9 36.68,30.88 38.02,32.22 40.14,32.22 41.25,31.11 45.07,31.11 45.5,30.68 47.86,30.68 48.65,29.89 48.65,29.47 48.28,29.1 v48.28,28.82 | v48.95,19.2 48.95,19.87 49.25,20.17 50.88,20.17 53.23,17.82 55.5,17.82 58.8,21.11 58.8,24.2 | v58.2,25.4 58.2,24.8 58.8,24.2 | 58.8,24.2 58.8,26.13 59.57,26.9 61.7,26.9 v61.85,27.05 | v59.27,19.72 59.27,19.44 59.36,19.36 59.36,18.68 59.28,18.61 59.28,14.91 62.01,12.18 67.34,12.18 70.43,15.28 U3.9
D7_IO
  Bottom 0.152: U3.12 89.58,15.28 93.3,19 95.3,19 PCB1.47
DMA  (via drill 0.3)
  Top 0.152: FPGA.74 22.2,38.74 22.2,39.4 20.11,41.49 v20.01,41.49
  Bottom 0.152: v20.01,41.49 20.21,41.69 20.21,42.14 21.53,43.47 21.66,43.59 23.9,45.83 74.04,45.83 74.18,45.97 U6.7
DMA_IO
  Bottom 0.152: U6.14 86.4,45.99 90.12,45.99 92.39,48.26 PCB1.22
EEPROM_PGM  (via drill 0.3)
  Top 0.152: FPGA.75 20.51,39.35 v20.51,39.45
  Bottom 0.152: v20.51,39.45 20.51,42.01 23.82,45.32 U6.6
EEPROM_PGM_IO
  Bottom 0.152: U6.15 90.32,45.32 92,47 95.26,47 PCB1.23
EXT_CLK
  Top 0.152: FPGA.88 12.71,36.28 EXT_XO.5
GND  (via drill 0.3)
  Top 0.152: C4.2 15.33,40.6 16,40.6 17.29,39.31 17.29,38.07 FPGA.79 18.76,36.6 v18.85,36.6
  other vias: 38,13 73.35,43.6 39.3,35.9 44.55,35.9 44.4,34.5 45.3,33.1 46.4,31.7 45.5,20.5 45.2,22.85 47.65,24.9 50.65,29.4 59.1,30.1 73.5,21.7 92.2,21.15 74.4,31.35 92.1,30.55 92.1,42.15 74.75,42.55 16.65,44.85 33.35,30.35 33,35.95 48,6.5 43.6,27.8 23.35,27.8 21.95,22.75 22.5,33.45 10.45,37.2 21.25,18.3 72.6,10.65 92.4,10.7 20.7,27.25 27.55,12.4
  pour Top: -4.5,55.5 -4.5,-2.05 105.65,-2.05 105.75,-1.95 105.75,54.35 105.6,54.5 104.6,55.5
  pour Bottom: -7.5,57.5 -7.5,-4 107.5,-4 107.5,57.5
IO_EN  (via drill 0.3)
  Top 0.152: FPGA.16 17.5,24.14 v17.5,24.65 | v43.3,13.15 43.41,13.15 PIO.19
  Bottom 0.152: v43.3,13.15 42.2,14.25 42.2,23 40.74,24.46 17.69,24.46 v17.5,24.65
IRQ_COPROC  (via drill 0.3)
  Top 0.152: FPGA.7 13.34,26.35 13.34,26.36 13.73,26.75 v14.25,26.75
  Bottom 0.152: v14.25,26.75 14.25,33.03 20.16,38.94 20.72,38.94 21.45,39.67 21.45,42.15 23.97,44.67 U6.5
IRQ_COPROC_IO
  Bottom 0.152: U6.16 90.37,44.67 91.42,45.72 PCB1.24
IRQ_IO  (via drill 0.3)
  Top 0.152: FPGA.8 12,24.3 v12,18.58 | v42.15,12.05 43.88,10.31 PIO.17
  Bottom 0.152: v42.15,12.05 39.6,14.6 39.6,17.6 38.4,18.8 38.4,19.7 37.8,20.3 25.6,20.3 25.55,20.25 21.92,20.25 20,18.33 12.25,18.33 v12,18.58
IRQN  (via drill 0.3)
  Top 0.152: FPGA.70 v21.98,35.69 v21.98,35.68 | CPU.43 56.09,11.66 53.57,9.15 v53.25,9.15
  Bottom 0.152: v21.98,35.68 21.98,35.03 21.75,34.8 21.2,34.8 21.19,34.81 16.55,30.16 16.55,27.2 16.84,26.91 16.86,26.91 18.33,25.44 41.18,25.44 43.16,23.45 43.16,16.34 51,8.5 52.55,8.5 53.2,9.15 v53.25,9.15
LED_0  (via drill 0.3)
  Top 0.152: FPGA.76 19.38,39 v19.5,39 | v4.5,19.5 R5.2
  Bottom 0.152: v19.5,39 9,39 7.21,37.2 7.21,22.2 v4.5,19.5
LED_1  (via drill 0.3)
  Top 0.152: FPGA.77 17.8,38.97 17.8,39.7 18.1,40 v19.5,40 | v4.45,23.05 4.45,23.02 R6.2
  Bottom 0.152: v19.5,40 18.85,39.35 8.85,39.35 6.9,37.4 6.9,28 4.45,25.55 v4.45,23.05
LED_2  (via drill 0.3)
  Top 0.152: FPGA.81 16.55,37.4 15.75,37.4 13.1,40.05 13.1,40.61 13.3,40.81 14.19,40.81 15.08,41.7 18.8,41.7 v19.5,41 | R7.2 v4.45,26.55
  Bottom 0.152: v19.5,41 18.2,39.7 8.75,39.7 6.59,37.55 6.59,29.98 4.45,27.84 v4.45,26.55
LED_3  (via drill 0.3)
  Top 0.152: FPGA.82 16.24,37 14.8,37 14.31,37.49 14.31,38.38 13.28,39.41 12.94,39.41 12.67,39.68 12.67,40.68 13.11,41.11 14.06,41.11 14.95,42.01 v19.5,42.01 v19.5,42 | R8.2 4.44,30.06 v4.45,30.05
  Bottom 0.152: v19.5,42 19.5,41.75 17.85,40.1 8.67,40.1 6.25,37.68 6.25,31.85 v4.45,30.05
LED_4  (via drill 0.3)
  Top 0.152: FPGA.85 14.96,36.16 14.41,36.16 14.01,36.55 14.01,38.25 13.15,39.11 12.56,39.11 12.36,39.3 12.36,40.8 12.98,41.42 13.93,41.42 14.83,42.31 18.81,42.31 v19.5,43 | R9.2 v4.99,33.61 v5,33.6
  Bottom 0.152: v19.5,43 18.8,42.3 18.8,41.5 17.72,40.42 8.55,40.42 5.85,37.71 5.85,34.45 v5,33.6
LED_5  (via drill 0.3)
  Top 0.152: FPGA.86 14.56,35.85 14.28,35.85 13.71,36.43 13.71,38.13 13.03,38.8 12.43,38.8 12.06,39.18 12.06,40.93 12.85,41.72 13.81,41.72 14.7,42.61 18.11,42.61 v19.5,44 | v5,38.5 4.5,38 4.3,38 R4.2
  Bottom 0.152: v19.5,44 18.45,42.95 18.45,41.65 17.53,40.73 8.44,40.73 6.21,38.5 v5,38.5
LED_6  (via drill 0.3)
  Top 0.152: FPGA.87 13.4,36.3 13.4,38 12.9,38.5 12.3,38.5 11.76,39.05 11.76,41.05 12.73,42.03 13.68,42.03 14.61,42.95 18.02,42.95 18.85,43.78 18.85,44.45 19.4,45 v19.5,45 | R2.2 4.85,40.6 v4.9,40.65
  Bottom 0.152: v19.5,45 18.1,43.6 18.1,41.8 17.34,41.04 8.31,41.04 7.93,40.65 v4.9,40.65
N$9
  Top 0.152: R5.1 1.65,21.2 D1.2
N$10
  Top 0.152: R6.1 1.65,24.7 D2.2
N$11
  Top 0.152: R7.1 1.7,28.25 D5.2
N$12
  Top 0.152: R8.1 1.7,31.8 D4.2
N$13
  Top 0.152: R9.1 1.7,35.3 D3.2
N$14
  Top 0.152: R4.1 1.7,38.8 D6.2
N$15
  Top 0.152: R2.1 1.7,42.3 D7.2
N$31
  Top 0.152: R18.1 53.5,11.6 53.76,11.6 CPU.41
N$32
  Top 0.152: JP3.2 70.71,47.59 68.96,49.34 67.94,49.34 R19.2
OE  (via drill 0.3)
  Top 0.152: FPGA.66 29.31,40.2 47,40.2 | 47,40.2 63.2,40.2 | 63.2,40.2 70.69,40.2 74,43.5 v74,44 | 47,40.2 47.58,40.77 RAM.1 | EEPROM.1 62.91,40.48 63.2,40.2
  Bottom 0.152: v74,44 80.62,44 U6.4
OE_IO
  Bottom 0.152: U6.17 90.52,44.02 91,44.5 95.3,44.5 PCB1.25
PA0  (via drill 0.3)
  Top 0.152: v29.35,17.4 29.35,18.4 29.92,18.97 34.2,18.97 PIO.40
  Bottom 0.152: U4.9 31.43,14.21 29.3,16.34 29.3,17.35 v29.35,17.4
PA0_IO
  Bottom 0.152: U4.12 21.06,14.21 JP2.1
PA1  (via drill 0.3)
  Top 0.152: PIO.41 33.37,18.66 30.45,18.66 30.08,18.3 v30.08,18.17
  Bottom 0.152: v30.08,18.17 29.88,17.97 29.88,16.19 31.21,14.87 U4.8
PA1_IO
  Bottom 0.152: U4.13 19.17,14.87 JP2.3
PA2  (via drill 0.3)
  Top 0.152: PIO.42 32.55,18.36 31,18.36 v30.79,18.14
  Bottom 0.152: v30.79,18.14 30.45,17.81 30.44,17.81 30.19,17.56 30.19,16.31 30.99,15.52 U4.7
PA2_IO
  Bottom 0.152: U4.14 17.28,15.52 JP2.5
PA3  (via drill 0.3)
  Top 0.152: PIO.43 31.82,17.96 31.35,17.96 31.15,17.76 v31.15,17.51
  Bottom 0.152: v31.15,17.51 30.64,17.51 30.49,17.36 30.49,16.49 30.82,16.16 U4.6
PA3_IO
  Bottom 0.152: U4.15 15.39,16.16 JP2.7
PA4  (via drill 0.3)
  Top 0.152: PIO.44 31.84,16.8 v31.1,16.8
  Bottom 0.152: v31.1,16.8 32.49,16.8 U4.5
PA4_IO
  Bottom 0.152: U4.16 13.5,16.82 JP2.9
PA5  (via drill 0.3)
  Top 0.152: PIO.1 34.4,15.06 34.4,15.85 v34.75,16.2
  Bottom 0.152: v34.75,16.2 33.48,17.46 U4.4
PA5_IO
  Bottom 0.152: U4.17 26.71,17.41 11.56,17.41 JP2.11
PA6  (via drill 0.3)
  Top 0.152: PIO.2 34.85,14.38 34.85,15.35 v35.65,16.15
  Bottom 0.152: v35.65,16.15 33.69,18.11 U4.3
PA6_IO
  Bottom 0.152: U4.18 25.82,18.11 25.42,17.72 9.33,17.72 JP2.13
PA7  (via drill 0.3)
  Top 0.152: PIO.3 35.5,13.89 v35.5,14.9
  Bottom 0.152: v35.5,14.9 36.6,14.9 38.05,16.35 38.05,19.5 37.55,20 34.24,20 33.66,19.41 U4.1
PA7_IO
  Bottom 0.152: U4.20 26.59,19.41 26.05,19.95 22.15,19.95 20.23,18.02 7.09,18.02 JP2.15
PB0  (via drill 0.3)
  Top 0.152: PIO.4 32.99,10.25 32.85,10.25 31.65,10.25 31.05,10.85 v31.05,11.8
  Bottom 0.152: v31.05,11.8 31.05,10.85 31.69,10.21 U5.1
PB0_IO
  Bottom 0.152: U5.20 26,11 20.39,11 JP2.2
PB1  (via drill 0.3)
  Top 0.152: PIO.6 33.9,8.9 v31.15,8.9
  Bottom 0.152: v31.15,8.9 31.4,8.9 31.41,8.91 U5.3
PB1_IO
  Bottom 0.152: U5.18 26.01,8.91 24.6,7.5 20.55,7.5 JP2.4
PB2  (via drill 0.3)
  Top 0.152: PIO.7 34.82,8.69 34.66,8.69 34.21,8.25 v34.05,8.25
  Bottom 0.152: v34.05,8.25 U5.4
PB2_IO
  Bottom 0.152: U5.17 25.79,8.26 24.73,7.2 18.32,7.2 JP2.6
PB3  (via drill 0.3)
  Top 0.152: PIO.8 35.45,8.19 v34.87,8.19
  Bottom 0.152: v34.87,8.19 34.29,7.61 U5.5
PB3_IO
  Bottom 0.152: U5.16 25.57,7.61 24.85,6.89 16.08,6.89 JP2.8
PB4  (via drill 0.3)
  Top 0.152: PIO.9 35.34,6.95 v34.6,6.95
  Bottom 0.152: v34.6,6.95 U5.6
PB4_IO
  Bottom 0.152: U5.15 25.36,6.96 24.99,6.59 13.85,6.59 JP2.10
PB5  (via drill 0.3)
  Top 0.152: PIO.10 35.83,6.3 v34.2,6.3
  Bottom 0.152: v34.2,6.3 U5.7
PB5_IO
  Bottom 0.152: JP2.12 11.61,6.28 26.76,6.28 U5.14
PB6  (via drill 0.3)
  Top 0.152: PIO.11 36.31,5.65 v34.75,5.65
  Bottom 0.152: v34.75,5.65 U5.8
PB6_IO
  Bottom 0.152: JP2.14 4.75,10.45 9.28,5.93 24.97,5.93 25.24,5.66 U5.13
PB7  (via drill 0.3)
  Top 0.152: v34.3,5 36.72,5 38.22,6.51 40.51,6.51 41.16,7.16 PIO.12
  Bottom 0.152: v34.3,5 U5.9
PB7_IO
  Bottom 0.152: JP2.16 7.25,5.56 24.89,5.56 25.44,5.01 U5.12
PB_RESET
  Top 0.152: PB_RESET.T3 7.21,21.71 7.21,23.14 10.45,26.38 10.55,26.38 FPGA.3
PB_STEP
  Top 0.152: FPGA.2 6.7,23.24 6.7,15.6 8.6,13.7 8.6,9.5 PB_STEP.T3
RAM_EN  (via drill 0.3)
  Top 0.152: FPGA.17 16.85,22.78 16.95,22.78 18.33,24.16 18.33,24.57 17.65,25.25 v17.65,26.9 | v47.1,27.45 47.02,27.52 RAM.27
  Bottom 0.152: v17.65,26.9 18.79,25.76 46.76,25.76 47.1,26.1 v47.1,27.45
RESETN  (via drill 0.3)
  Top 0.152: FPGA.21 13.5,16.61 13.5,15.5 14.5,14.5 20.25,14.5 27.25,7.5 v29,7.5 | v37.21,13.9 39.6,16.29 | PIO.31 39.6,17.99 39.6,16.29 | 39.6,16.29 44.26,16.29 v45.6,14.95 | v50.9,12.4 51.17,12.4 CPU.38
  Bottom 0.152: v29,7.5 29,12 30,13 36.31,13 v37.21,13.9 | v45.6,14.95 45.6,14.33 48.73,11.2 49.75,11.2 52.48,13.97 v50.9,12.4
ROM_EN  (via drill 0.3)
  Top 0.152: FPGA.20 18.64,22.46 18.64,26.71 v18.35,27 | v62.35,27.75 62.36,27.76 EEPROM.27
  Bottom 0.152: v18.35,27 18.35,26.71 19,26.06 45.56,26.06 46.15,26.65 46.15,27.85 46.5,28.2 47.35,28.2 47.57,27.98 47.57,27.7 47.97,27.3 61.35,27.3 61.8,27.75 v62.35,27.75
RW  (via drill 0.3)
  Top 0.152: FPGA.71 21.31,35.73 v21.31,35.35 | v49.45,11.75 49.05,11.75 47.55,10.25 45.18,10.25 PIO.18 42.53,12.9 v42.4,12.9 | v53.5,16.95 53.5,18.27 CPU.32
  Bottom 0.152: v21.31,35.35 16.11,30.15 16.11,25.28 17.27,24.11 40.57,24.11 41.85,22.83 41.85,13.45 v42.4,12.9 | v49.45,11.75 53.5,15.8 v53.5,16.95
SW_RUNHALT
  Top 0.152: FPGA.1 6.29,23.54 6.29,19.29 3.56,16.57 SW_RUNHALT.1
TCK
  Top 0.152: FPGA.91 12.95,33.92 12.95,34.45 11.14,36.26 11.14,41.35 12.43,42.64 13.43,42.64 14.61,43.82 14.61,45.63 13.74,46.51 | JP1.4 10.15,50.42 10.15,47.1 10.74,46.51 13.74,46.51 | 13.74,46.51 15.04,46.51 R3.2
TDI
  Top 0.152: FPGA.94 11.85,32.9 10.5,32.9 8.5,34.9 8.5,36 10.84,38.34 10.84,41.48 12.3,42.94 13.3,42.94 14.31,43.95 14.31,45.5 13.62,46.2 13.51,46.2 13.5,46.2 9.04,46.2 8.22,47.02 8.22,48.45 JP1.3
TDO
  Top 0.152: 7.66,48.59 | 7.66,48.59 7.66,47.15 8.91,45.89 13.49,45.89 14.01,45.38 14.01,44.07 13.18,43.24 12.18,43.24 10.53,41.6 10.53,38.47 8.2,36.13 8.2,34.77 10.47,32.5 11.54,32.5 FPGA.95 | JP1.2 7.66,50.38 7.66,48.59
TMS
  Top 0.152: FPGA.90 13.26,34.33 13.26,34.58 11.45,36.38 11.45,41.18 12.6,42.33 13.55,42.33 14.52,43.3 16.45,43.3 17.2,44.05 17.2,45.8 11.44,51.56 JP1.6
VCC  (via drill 0.3)
  Top 0.254: 85,11.5 85,5.5 84.5,5 57,5 | 85,11.5 v85,16.5 85,25 | 85,25 v85,28 v85,32 v85,37.5 v85,43.5 | v85,43.5 v85,47.45 76.45,47.45 73.1,44.1 C27.1 | v79.2,10.7 84.2,10.7 85,11.5 | C4.1 16.07,38.58 FPGA.80 19.33,35.33 19.33,30.37 20.15,29.55 | C1.1 FPGA.73 20.75,36.58 20.75,34.3 21,34.05 21,30.35 20.2,29.55 20.2,29.5 | C2.1 30.03,33.13 FPGA.55 26.84,29.95 20.55,29.95 20.15,29.55 | C23.1 10.3,30 10.51,30 FPGA.100 11.06,29.45 20.1,29.45 | C3.1 11.25,34.21 FPGA.93 15.56,29.9 19.7,29.9 20.1,29.5 | C20.1 22.83,17.68 FPGA.26 20.7,19.81 20.7,21.2 21.35,21.85 21.35,28.35 20.25,29.45 | C6.1 16.67,18.36 FPGA.23 19.6,21.29 19.6,29 | C5.1 10.25,24.67 FPGA.5 14.53,28.95 19.55,28.95 19.6,29 | 33.1,5 12.5,5 9,1.5 2,1.5 0.61,2.89 0.61,43 | 33.1,5 v34.05,4.05 PCB1.3.3V 38.02,5 47.11,5 | R18.2 v51.1,9.2 | 57,5 58.1,6.1 58.1,14.8 | 0.61,43 0.61,44.35 1.26,45 3.5,45 4.25,45.75 C7.1 4.25,47.02 JP1.1 | EXT_XO.8 11.9,44 1.61,44 0.61,43 | v82.5,23.5 83.5,23.5 85,25 | 58.1,14.8 v56.4,16.5 CPU.31 52.2,20.7 52.15,20.7 C25.1 | C22.1 FPGA.50 28.03,29.45 20.25,29.45 | C27.1 44.45,44.1 C28.1 44.27,44.02 RAM.7 | EEPROM.7 59.61,44.06 C27.1 | v85,43.5 84.2,42.7 v81.95,42.7 | 33.1,5 29.65,8.45 | 29.65,8.45 20.11,17.99 20.11,19.23 20.1,19.24 20.1,29.35 | 20.1,29.35 20.1,29.45 | 20.1,29.45 20.1,29.5 | 20.2,29.5 20.25,29.5 20.2,29.45 | 20.2,29.5 20.1,29.5 | 19.6,29 20.1,29.5 | 20.2,29.5 20.15,29.55 | 20.1,29.5 20.15,29.55 | 20.25,29.45 20.2,29.45 | 20.2,29.45 20.1,29.35 | 20.2,29.5 20.77,28.93 25.73,28.93 FPGA.46 28.38,26.23 C21.1 | v29.65,13.55 v29.65,9.75 29.65,8.45 | PIO.20 44.1,13.59 44.1,13.6 43.55,14.15 41.7,14.15 40.45,12.9 40.45,11.59 PIO.15 45.16,6.88 C24.1 47.11,5
  Top 0.254: 57,5 47.11,5 | C25.1 | C26.1 62.33,10.58 CPU.3 58.95,13.96 | CPU.1 58.95,11.69 58.95,13.96 | 58.1,14.8 58.8,14.1 58.8,14.11 58.95,13.96
  Bottom 0.254: C8.1 77.93,10.7 v79.2,10.7 80.6,10.7 U3.2 | C13.1 35.04,9.56 U5.2 29.84,9.56 v29.65,9.75 | C12.1 U1.2 84.5,31.5 v85,32 | C9.1 U2.2 81.8,21.9 82.5,22.6 v82.5,23.5 | v85,28 84.1,27.1 U2.10 | v85,37.5 84.2,36.7 U1.10 | v85,47.45 84.53,47.92 U6.10 | v51.1,9.2 56.4,14.5 v56.4,16.5 | C10.1 78.07,42.72 U6.2 80.66,42.7 v81.95,42.7 | v85,16.5 84.42,15.93 U3.10 | U5.10 33.74,4.36 v34.05,4.05 | C11.1 35.02,18.77 U4.2 29.89,18.77 28.79,17.67 28.79,16.34 29.65,15.49 29.65,14.45 | 29.65,14.45 v29.65,13.55 | U4.10 30.54,13.56 29.65,14.45
VCCIO  (via drill 0.3)
  Top 0.254: PCB1.5V 40.06,4.5 85,4.5 89.2,8.7 89.2,11.5 | PCB1.5V. PCB1.5V.. 95.17,50.8 93.87,49.5 91.85,49.5 91.04,48.69 89.2,46.85 | 89.2,11.5 89.2,23 | 89.2,23 89.2,32.5 | 89.2,32.5 89.2,44 | 89.2,44 89.2,46.85 | v87.65,10.7 88.4,10.7 89.2,11.5 | JP3.1 75.53,49.49 86.56,49.49 89.2,46.85 | 89.2,23 88.1,21.9 v87.7,21.9 | 89.2,44 87.92,42.72 v87.7,42.72 | 89.2,32.5 88.2,31.5 v87.6,31.5
  Bottom 0.254: U3.19 86.4,10.7 v87.65,10.7 89,10.7 C14.1 | C19.1 24.55,9.56 U5.19 28.06,9.56 28.36,9.26 | C18.1 U4.19 27.75,18.77 28.36,18.16 28.36,9.26 | PCB1.5V 37.28,2.54 36.06,1.32 29.98,1.32 29.16,2.14 29.16,3.04 28.36,3.85 28.36,9.26 | U2.19 v87.7,21.9 C17.1 | U1.19 v87.6,31.5 89.01,31.5 C15.1 | U6.19 v87.7,42.72 89.01,42.72 C16.1
WE  (via drill 0.3)
  Top 0.152: FPGA.67 28.91,40.5 44,40.5 | 44,40.5 44.83,41.33 RAM.6 | 44,40.5 44.7,40.5 v44.9,40.7 | v60.14,40.7 60.16,40.72 EEPROM.6
  Bottom 0.152: v44.9,40.7 44.9,42.48 44.54,42.83 44.54,43.25 45.65,44.36 59,44.36 | 59,44.36 60.14,43.22 v60.14,40.7 | 59,44.36 71.84,44.36 74.65,41.55 79.03,41.55 79.54,42.07 U6.1
WE_IO
  Bottom 0.152: U6.20 86.95,41.5 93.12,41.5 PCB1.28

## Text on the board
tPlace: FPGA | XO | TDO | TDI | TCK | VCC | TMS | GND | CLOCK SELECT | FPGA / JTAG | GND | LCD | 5 VDC | FPGA | PIO | OPTIONAL / 3.3VDC XO | RAM | ROM | IRQ | R/W | CLK | RESET | PA0 | github.com/impavidus | PB0 | 3.3V | 5V | GND | HALT | RUN | STEP
bPlace: 6502-shield / REV B